# Altium schematic sheet Pressure sensor - SCP1000-D01.SchDoc: Pressure sensor -SPI
size A4; Organization: Altium Limited; Address1: 3 Minna Close; Address2: Belrose; Address3: NSW 2085; Address4: Australia
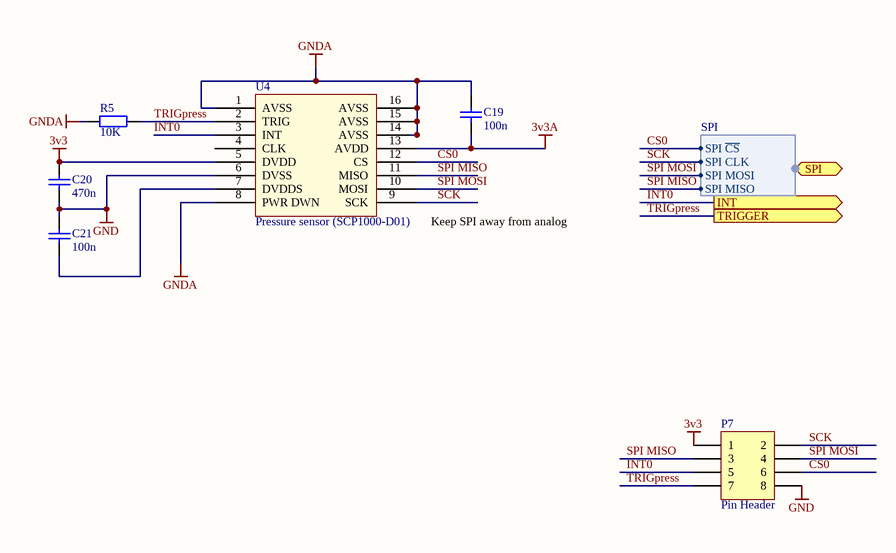
[diagram p0: Pressure sensor - SCP1000-D01.SchDoc]

## Parts
C19  100n  [C0805]
C20  470n  [C0805]
C21  100n  [C0805]
P7  Pin Header  [PH2x4_2.54]
R5  value 10K  [R0805]  (hidden comment: RESISTOR)
U4  Pressure sensor (SCP1000-D01)  [SCP1000-D01]

## Ports
INT (out), SPI (harness SPI), TRIGGER (out)

## Harnesses
SPI: SPI ~{CS}, SPI CLK, SPI MOSI, SPI MISO

## Nets
3v3: C20.2 P7.1 U4.5(DVDD)
3v3A: C19.1 U4.13(AVDD)
GND: C20.1 C21.2 P7.8 U4.6(DVSS)
GNDA: C19.2 R5.1 U4.1(AVSS) U4.8(PWR_DWN) U4.14(AVSS) U4.15(AVSS) U4.16(AVSS)
CS0: P7.6 U4.12(CS) ; port SPI.SPI ~{CS}
INT0: P7.5 U4.3(INT) ; port INT
SCK: P7.2 U4.9(SCK) ; port SPI.SPI CLK
SPI MISO: P7.3 U4.11(MISO) ; port SPI.SPI MISO
SPI MOSI: P7.4 U4.10(MOSI) ; port SPI.SPI MOSI
TRIGpress: P7.7 R5.2 U4.2(TRIG) ; port TRIGGER
NetC21_1: C21.1 U4.7(DVDDS)

Not connected (* = marked no-connect by the designer): U4 4(CLK)

## Notes on the sheet
- Keep SPI away from analog
- Disclaimer
  Any design and information, hardware or software  is provided on an "as-is" basis without warranty of any kind and any express or implied warranties, including, but not limited to, the implied warranties of merchantability and fitness for a particular purpose are disclaimed. In no event shall wnpd (or KeaDrone)be liable for any direct, indirect, incidental, special, exemplary, or consequential damages (including, but not limited to, procurement of substitute goods or services; loss of use, data, or profits; or business interruption) however caused and on any theory of liability, whether in contract, strict liability, or tort (including negligence or otherwise) arising in any way out of the use of this firmware, hardware, software or information, even if wnpd (or KeaDrone) has been advised by user of the possibility of such potential loss or damage. The user agrees to hold wnpd (or KeaDrone) harmless from and against any and all claims, losses, liabilities and expenses.
- Title
- Size:
- Date:
- A4
- Name:
- Time:
- Ing. W. Pietersz
- Revision:
- Sheet
- of
- WillyPietersz@gmail.com
- Contact:
- -
- www.wnpd.nl
- File:

## Library data of the parts
C19 C21 = 100n: Tolerance: 0.1; LatestRevision Note: Initial Release; Part Number: 100n; Value: 100n; Package: 0805; Component Type: Standard; LatestRevision Date: 31-7-2010; Author: Willy Pietersz; Supplier 2: Farnell; Supplier Part Number 2: 1759266; ComponentLink1Description: Manufacturer; ComponentLink2Description: Datasheet
C20 = 470n: Tolerance: 0.1; LatestRevision Note: Initial Release; Part Number: 470n; Value: 470n; Package: 0805; Component Type: Standard; LatestRevision Date: 31-7-2010; Author: Willy Pietersz; ComponentLink1Description: Manufacturer; ComponentLink2Description: Datasheet
P7 = PH2x4: Header, 4-Pin, Dual row; Part Number: PH2x4; Pitch: 2.54; LatestRevision Note: Initial Release; Type: Pin Header; Number Of Pins: 8; Component Type: Standard; LatestRevision Date: 23-11-2010; Author: Willy Pietersz; Supplier 2: Farnell
R5 = 10K: Manufacturer 1: Panasonic; Manufacturer 1 Part No: ERJT06J103V; Power: 0.25W; Tolerance: 0.05; LatestRevision Note: Initial Release; Published: 8-Jun-2000; LatestRevisionDate: 17-Jul-2002; LatestRevisionNote: Re-released for DXP Platform.; PackageReference: AXIAL-0.4; Publisher: Altium Limited; Part Number: 10K; Type: Film; Package: 0805; Component Type: Standard; LatestRevision Date: 30-7-2010; Author: Willy Pietersz; ROHS: Y; Supplier 2: Farnell; Supplier Part Number 2: 1618242; ComponentLink1Description: Manufacturer; ComponentLink2Description: Datasheet
U4 = SCP1000-D01: Part Number: SCP1000-D01; Component Type: Sensor; Supplier 1: Sparkfun; Supplier Part Number 1: SCP1000-D01; ComponentLink1Description: Datasheet; ComponentLink1URL: http://www.sparkfun.com/datasheets/Components/SCP1000-D01.pdf